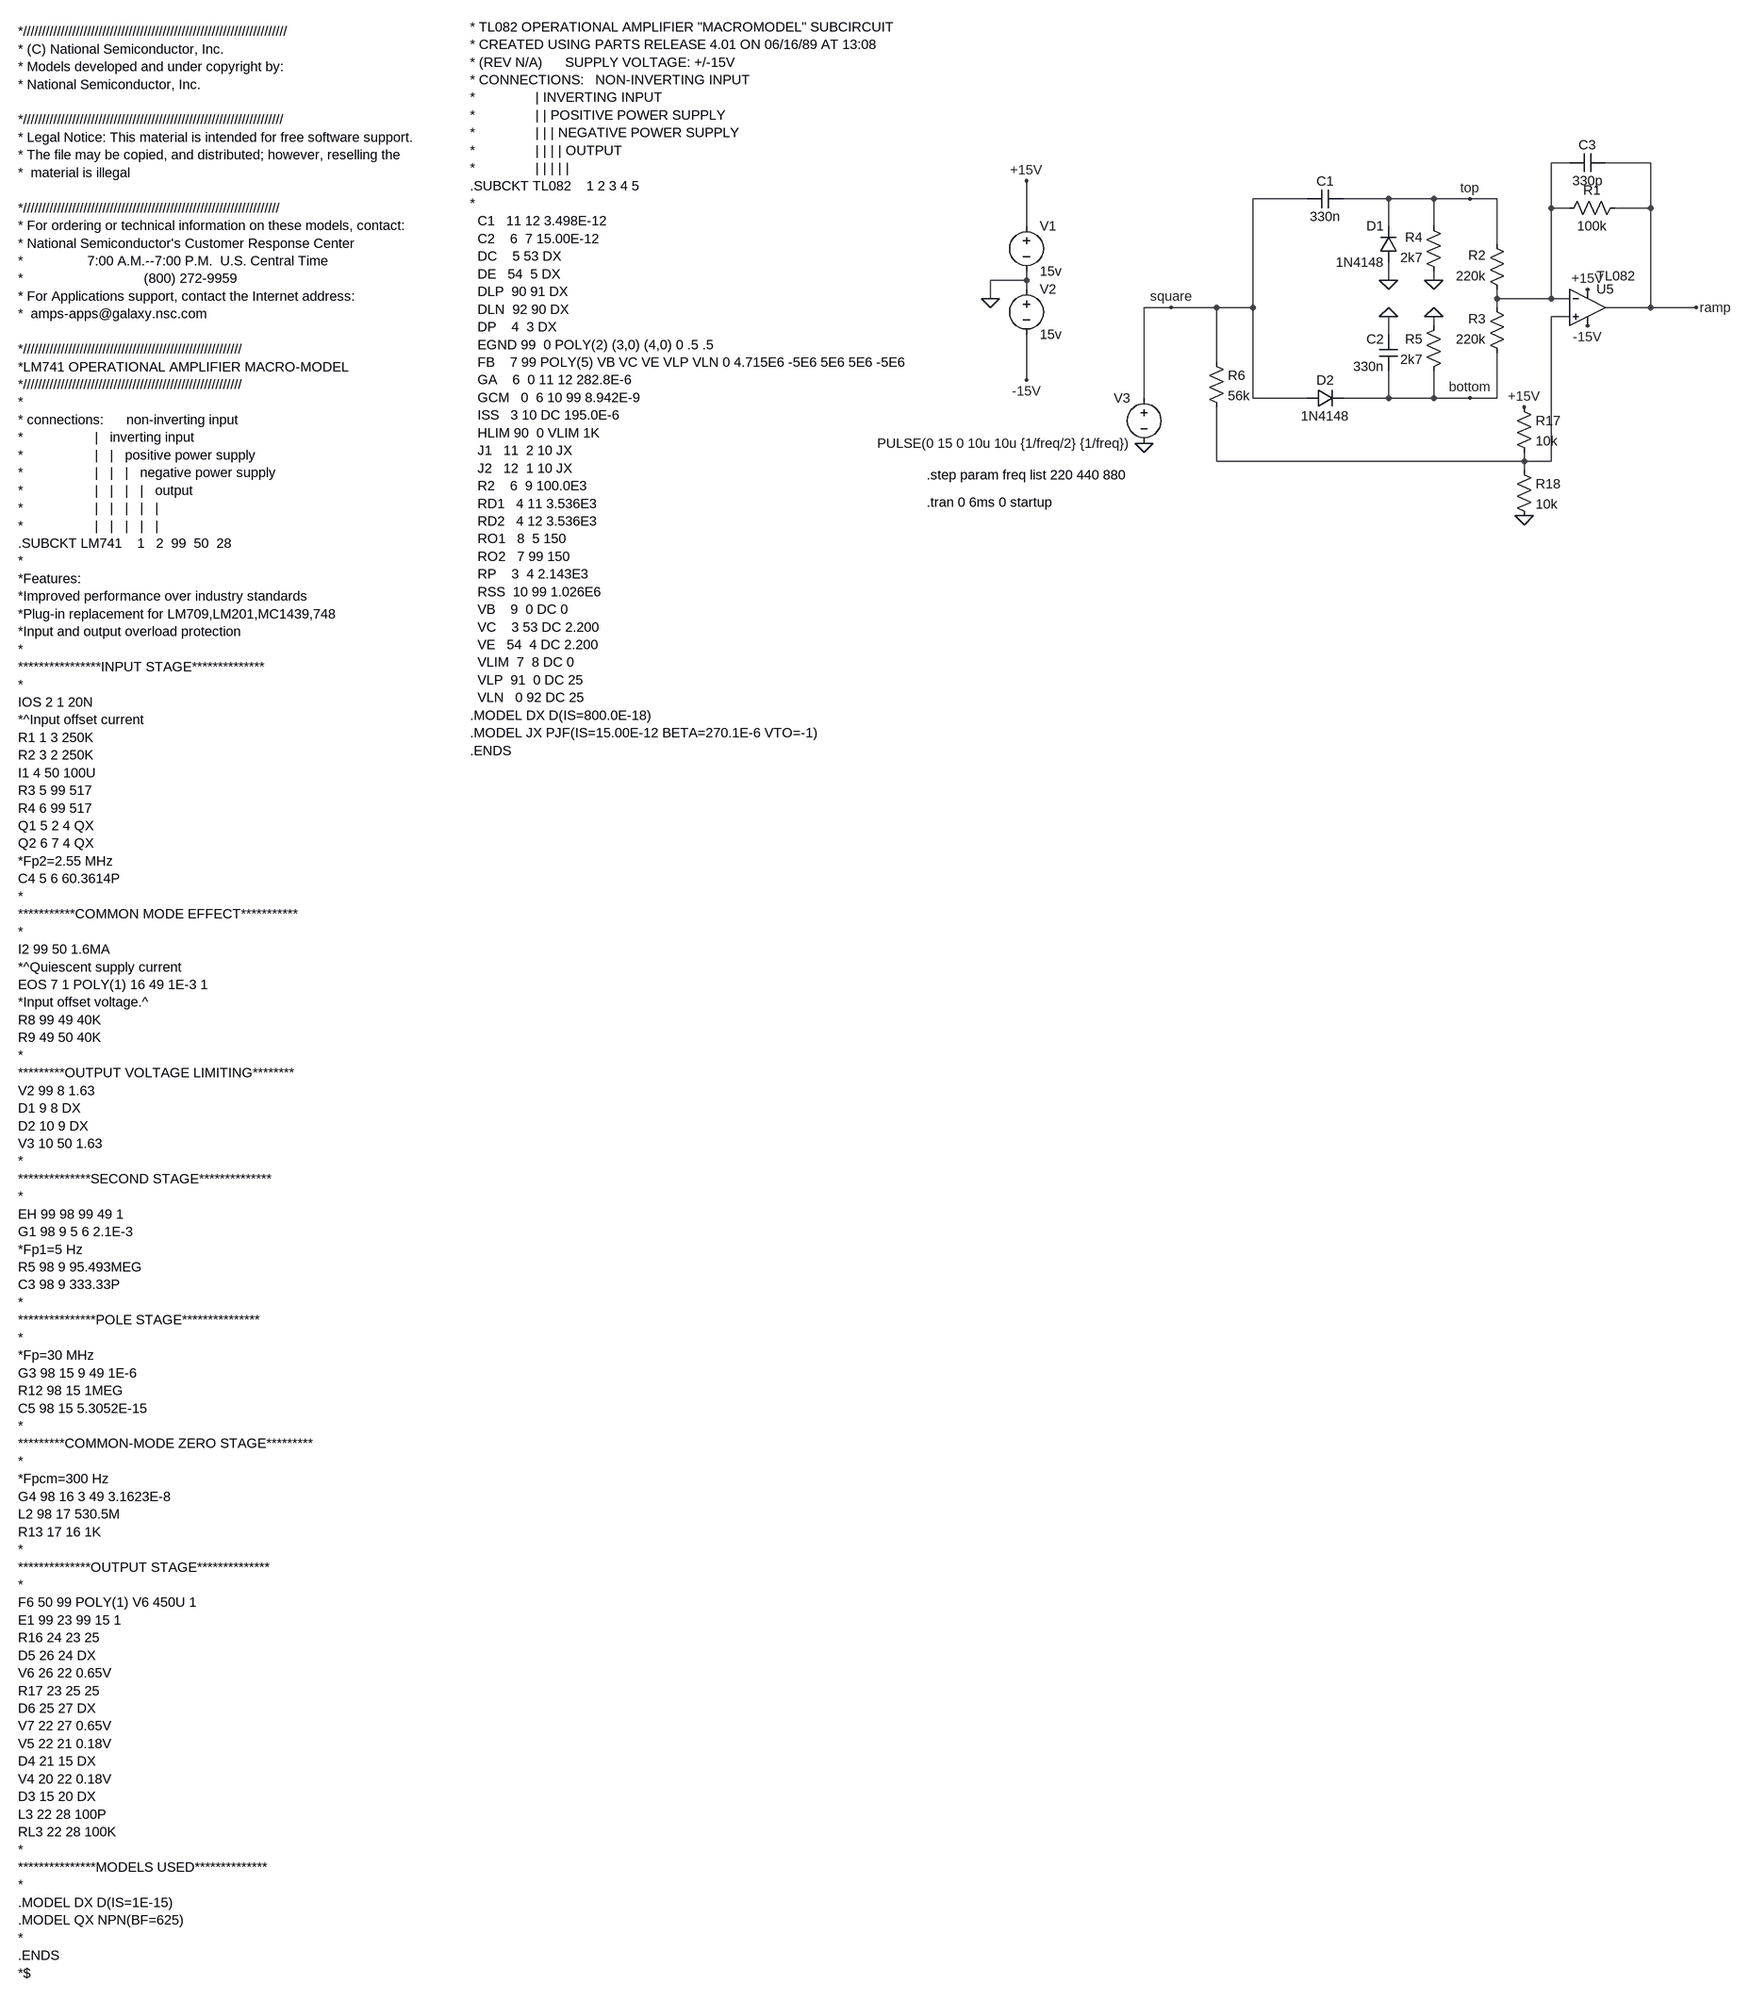
[diagram p0: schematic square2ramp.asc]
square2ramp.asc, the LTspice schematic file:
Version 4
SHEET 1 2688 2848
WIRE 272 -16 240 -16
WIRE 416 -16 336 -16
WIRE -192 48 -288 48
WIRE -48 48 -128 48
WIRE 32 48 -48 48
WIRE 96 48 32 48
WIRE 144 48 96 48
WIRE 240 64 240 -16
WIRE 272 64 240 64
WIRE 416 64 416 -16
WIRE 416 64 352 64
WIRE -688 96 -688 16
WIRE -48 96 -48 48
WIRE 32 96 32 48
WIRE 144 128 144 48
WIRE -688 192 -688 176
WIRE -688 192 -752 192
WIRE -48 192 -48 160
WIRE 32 192 32 176
WIRE -688 208 -688 192
WIRE -752 224 -752 192
WIRE 144 224 144 208
WIRE 240 224 240 64
WIRE 240 224 144 224
WIRE 272 224 240 224
WIRE -432 240 -480 240
WIRE -352 240 -432 240
WIRE -288 240 -288 48
WIRE -288 240 -352 240
WIRE 144 240 144 224
WIRE 416 240 416 64
WIRE 416 240 336 240
WIRE 496 240 416 240
WIRE 272 256 240 256
WIRE 32 272 32 256
WIRE -48 288 -48 256
WIRE -352 336 -352 240
WIRE -688 368 -688 288
WIRE -480 400 -480 240
WIRE -288 400 -288 240
WIRE -192 400 -288 400
WIRE -48 400 -48 352
WIRE -48 400 -128 400
WIRE 32 400 32 352
WIRE 32 400 -48 400
WIRE 96 400 32 400
WIRE 144 400 144 320
WIRE 144 400 96 400
WIRE -352 512 -352 416
WIRE 192 512 192 496
WIRE 192 512 -352 512
WIRE 240 512 240 256
WIRE 240 512 192 512
WIRE 192 528 192 512
FLAG -752 224 0
FLAG -688 16 +15V
FLAG -688 368 -15V
FLAG -480 480 0
FLAG 304 272 -15V
FLAG 304 208 +15V
FLAG 192 608 0
FLAG 192 416 +15V
FLAG -432 240 square
FLAG 496 240 ramp
FLAG -48 192 0
FLAG 32 192 0
FLAG -48 256 0
FLAG 32 256 0
FLAG 96 48 top
FLAG 96 400 bottom
SYMBOL voltage -688 80 R0
SYMATTR InstName V1
SYMATTR Value 15v
SYMBOL voltage -688 192 R0
SYMATTR InstName V2
SYMATTR Value 15v
SYMBOL voltage -480 384 M0
WINDOW 123 0 0 Left 0
WINDOW 39 0 0 Left 0
SYMATTR InstName V3
SYMATTR Value PULSE(0 15 0 10u 10u {1/freq/2} {1/freq})
SYMBOL Opamps\\opamp2 304 176 R0
WINDOW 3 16 8 Left 2
SYMATTR Value TL082
SYMATTR InstName U5
SYMBOL res 176 400 R0
SYMATTR InstName R17
SYMATTR Value 10k
SYMBOL res 176 512 R0
SYMATTR InstName R18
SYMATTR Value 10k
SYMBOL res 368 48 R90
WINDOW 0 0 56 VBottom 2
WINDOW 3 32 56 VTop 2
SYMATTR InstName R1
SYMATTR Value 100k
SYMBOL res 160 224 R180
WINDOW 0 36 76 Left 2
WINDOW 3 36 40 Left 2
SYMATTR InstName R2
SYMATTR Value 220k
SYMBOL res 160 336 R180
WINDOW 0 36 76 Left 2
WINDOW 3 36 40 Left 2
SYMATTR InstName R3
SYMATTR Value 220k
SYMBOL res 48 192 R180
WINDOW 0 36 76 Left 2
WINDOW 3 36 40 Left 2
SYMATTR InstName R4
SYMATTR Value 2k7
SYMBOL diode -32 160 R180
WINDOW 0 24 64 Left 2
WINDOW 3 24 0 Left 2
SYMATTR InstName D1
SYMATTR Value 1N4148
SYMBOL cap -128 32 R90
WINDOW 0 0 32 VBottom 2
WINDOW 3 32 32 VTop 2
SYMATTR InstName C1
SYMATTR Value 330n
SYMBOL res 48 256 M0
SYMATTR InstName R5
SYMATTR Value 2k7
SYMBOL diode -192 384 M90
WINDOW 0 0 32 VBottom 2
WINDOW 3 32 32 VTop 2
SYMATTR InstName D2
SYMATTR Value 1N4148
SYMBOL cap -32 288 M0
SYMATTR InstName C2
SYMATTR Value 330n
SYMBOL res -368 320 R0
SYMATTR InstName R6
SYMATTR Value 56k
SYMBOL cap 336 -32 R90
WINDOW 0 0 32 VBottom 2
WINDOW 3 32 32 VTop 2
SYMATTR InstName C3
SYMATTR Value 330p
TEXT -1672 -256 Left 2 !* TL082 OPERATIONAL AMPLIFIER "MACROMODEL" SUBCIRCUIT\n* CREATED USING PARTS RELEASE 4.01 ON 06/16/89 AT 13:08\n* (REV N/A)      SUPPLY VOLTAGE: +/-15V\n* CONNECTIONS:   NON-INVERTING INPUT\n*                | INVERTING INPUT\n*                | | POSITIVE POWER SUPPLY\n*                | | | NEGATIVE POWER SUPPLY\n*                | | | | OUTPUT\n*                | | | | |\n.SUBCKT TL082    1 2 3 4 5\n*\n  C1   11 12 3.498E-12\n  C2    6  7 15.00E-12\n  DC    5 53 DX\n  DE   54  5 DX\n  DLP  90 91 DX\n  DLN  92 90 DX\n  DP    4  3 DX\n  EGND 99  0 POLY(2) (3,0) (4,0) 0 .5 .5\n  FB    7 99 POLY(5) VB VC VE VLP VLN 0 4.715E6 -5E6 5E6 5E6 -5E6\n  GA    6  0 11 12 282.8E-6\n  GCM   0  6 10 99 8.942E-9\n  ISS   3 10 DC 195.0E-6\n  HLIM 90  0 VLIM 1K\n  J1   11  2 10 JX\n  J2   12  1 10 JX\n  R2    6  9 100.0E3\n  RD1   4 11 3.536E3\n  RD2   4 12 3.536E3\n  RO1   8  5 150\n  RO2   7 99 150\n  RP    3  4 2.143E3\n  RSS  10 99 1.026E6\n  VB    9  0 DC 0\n  VC    3 53 DC 2.200\n  VE   54  4 DC 2.200\n  VLIM  7  8 DC 0\n  VLP  91  0 DC 25\n  VLN   0 92 DC 25\n.MODEL DX D(IS=800.0E-18)\n.MODEL JX PJF(IS=15.00E-12 BETA=270.1E-6 VTO=-1)\n.ENDS
TEXT -864 584 Left 2 !.tran 0 6ms 0 startup
TEXT -2496 -248 Left 2 !*//////////////////////////////////////////////////////////////////////\n* (C) National Semiconductor, Inc.\n* Models developed and under copyright by:\n* National Semiconductor, Inc.  \n \n*/////////////////////////////////////////////////////////////////////\n* Legal Notice: This material is intended for free software support.\n* The file may be copied, and distributed; however, reselling the \n*  material is illegal\n \n*////////////////////////////////////////////////////////////////////\n* For ordering or technical information on these models, contact:\n* National Semiconductor's Customer Response Center\n*                 7:00 A.M.--7:00 P.M.  U.S. Central Time\n*                                (800) 272-9959\n* For Applications support, contact the Internet address:\n*  amps-apps@galaxy.nsc.com\n \n*//////////////////////////////////////////////////////////\n*LM741 OPERATIONAL AMPLIFIER MACRO-MODEL\n*//////////////////////////////////////////////////////////\n*\n* connections:      non-inverting input\n*                   |   inverting input\n*                   |   |   positive power supply\n*                   |   |   |   negative power supply\n*                   |   |   |   |   output\n*                   |   |   |   |   |\n*                   |   |   |   |   |\n.SUBCKT LM741    1   2  99  50  28\n*\n*Features:\n*Improved performance over industry standards\n*Plug-in replacement for LM709,LM201,MC1439,748\n*Input and output overload protection\n*\n****************INPUT STAGE**************\n*\nIOS 2 1 20N\n*^Input offset current\nR1 1 3 250K\nR2 3 2 250K\nI1 4 50 100U\nR3 5 99 517\nR4 6 99 517\nQ1 5 2 4 QX\nQ2 6 7 4 QX\n*Fp2=2.55 MHz\nC4 5 6 60.3614P\n*\n***********COMMON MODE EFFECT***********\n*\nI2 99 50 1.6MA\n*^Quiescent supply current\nEOS 7 1 POLY(1) 16 49 1E-3 1\n*Input offset voltage.^\nR8 99 49 40K\nR9 49 50 40K\n*\n*********OUTPUT VOLTAGE LIMITING********\nV2 99 8 1.63\nD1 9 8 DX\nD2 10 9 DX\nV3 10 50 1.63\n*\n**************SECOND STAGE**************\n*\nEH 99 98 99 49 1\nG1 98 9 5 6 2.1E-3\n*Fp1=5 Hz\nR5 98 9 95.493MEG\nC3 98 9 333.33P\n*\n***************POLE STAGE***************\n*\n*Fp=30 MHz\nG3 98 15 9 49 1E-6\nR12 98 15 1MEG\nC5 98 15 5.3052E-15\n*\n*********COMMON-MODE ZERO STAGE*********\n*\n*Fpcm=300 Hz\nG4 98 16 3 49 3.1623E-8\nL2 98 17 530.5M\nR13 17 16 1K\n*\n**************OUTPUT STAGE**************\n*\nF6 50 99 POLY(1) V6 450U 1\nE1 99 23 99 15 1\nR16 24 23 25\nD5 26 24 DX\nV6 26 22 0.65V\nR17 23 25 25\nD6 25 27 DX\nV7 22 27 0.65V\nV5 22 21 0.18V\nD4 21 15 DX\nV4 20 22 0.18V\nD3 15 20 DX\nL3 22 28 100P\nRL3 22 28 100K\n*\n***************MODELS USED**************\n*\n.MODEL DX D(IS=1E-15)\n.MODEL QX NPN(BF=625)\n*\n.ENDS\n*$
TEXT -864 536 Left 2 !.step param freq list 220 440 880

The netlist it stands for:
* square2ramp.asc
V1 +15V 0 15v
V2 0 -15V 15v
V3 square 0 PULSE(0 15 0 10u 10u {1/freq/2} {1/freq})
XU5 N002 N001 +15V -15V ramp TL082  ; pins In+ In- V+ V- OUT
R17 +15V N002 10k
R18 N002 0 10k
R1 ramp N001 100k
R2 N001 top 220k
R3 bottom N001 220k
R4 0 top 2k7
D1 0 top 1N4148
C1 top square 330n
R5 0 bottom 2k7
D2 square bottom 1N4148
C2 0 bottom 330n
R6 square N002 56k
C3 ramp N001 330p
.model D D
.lib standard.dio
* TL082 OPERATIONAL AMPLIFIER "MACROMODEL" SUBCIRCUIT
* CREATED USING PARTS RELEASE 4.01 ON 06/16/89 AT 13:08
* (REV N/A)      SUPPLY VOLTAGE: +/-15V
* CONNECTIONS:   NON-INVERTING INPUT
*                | INVERTING INPUT
*                | | POSITIVE POWER SUPPLY
*                | | | NEGATIVE POWER SUPPLY
*                | | | | OUTPUT
*                | | | | |
.SUBCKT TL082    1 2 3 4 5
*
  C1   11 12 3.498E-12
  C2    6  7 15.00E-12
  DC    5 53 DX
  DE   54  5 DX
  DLP  90 91 DX
  DLN  92 90 DX
  DP    4  3 DX
  EGND 99  0 POLY(2) (3,0) (4,0) 0 .5 .5
  FB    7 99 POLY(5) VB VC VE VLP VLN 0 4.715E6 -5E6 5E6 5E6 -5E6
  GA    6  0 11 12 282.8E-6
  GCM   0  6 10 99 8.942E-9
  ISS   3 10 DC 195.0E-6
  HLIM 90  0 VLIM 1K
  J1   11  2 10 JX
  J2   12  1 10 JX
  R2    6  9 100.0E3
  RD1   4 11 3.536E3
  RD2   4 12 3.536E3
  RO1   8  5 150
  RO2   7 99 150
  RP    3  4 2.143E3
  RSS  10 99 1.026E6
  VB    9  0 DC 0
  VC    3 53 DC 2.200
  VE   54  4 DC 2.200
  VLIM  7  8 DC 0
  VLP  91  0 DC 25
  VLN   0 92 DC 25
.MODEL DX D(IS=800.0E-18)
.MODEL JX PJF(IS=15.00E-12 BETA=270.1E-6 VTO=-1)
.ENDS
.tran 0 6ms 0 startup
*//////////////////////////////////////////////////////////////////////
* (C) National Semiconductor, Inc.
* Models developed and under copyright by:
* National Semiconductor, Inc.
*/////////////////////////////////////////////////////////////////////
* Legal Notice: This material is intended for free software support.
* The file may be copied, and distributed; however, reselling the
*  material is illegal
*////////////////////////////////////////////////////////////////////
* For ordering or technical information on these models, contact:
* National Semiconductor's Customer Response Center
*                 7:00 A.M.--7:00 P.M.  U.S. Central Time
*                                (800) 272-9959
* For Applications support, contact the Internet address:
*  amps-apps@galaxy.nsc.com
*//////////////////////////////////////////////////////////
*LM741 OPERATIONAL AMPLIFIER MACRO-MODEL
*//////////////////////////////////////////////////////////
*
* connections:      non-inverting input
*                   |   inverting input
*                   |   |   positive power supply
*                   |   |   |   negative power supply
*                   |   |   |   |   output
*                   |   |   |   |   |
*                   |   |   |   |   |
.SUBCKT LM741    1   2  99  50  28
*
*Features:
*Improved performance over industry standards
*Plug-in replacement for LM709,LM201,MC1439,748
*Input and output overload protection
*
****************INPUT STAGE**************
*
IOS 2 1 20N
*^Input offset current
R1 1 3 250K
R2 3 2 250K
I1 4 50 100U
R3 5 99 517
R4 6 99 517
Q1 5 2 4 QX
Q2 6 7 4 QX
*Fp2=2.55 MHz
C4 5 6 60.3614P
*
***********COMMON MODE EFFECT***********
*
I2 99 50 1.6MA
*^Quiescent supply current
EOS 7 1 POLY(1) 16 49 1E-3 1
*Input offset voltage.^
R8 99 49 40K
R9 49 50 40K
*
*********OUTPUT VOLTAGE LIMITING********
V2 99 8 1.63
D1 9 8 DX
D2 10 9 DX
V3 10 50 1.63
*
**************SECOND STAGE**************
*
EH 99 98 99 49 1
G1 98 9 5 6 2.1E-3
*Fp1=5 Hz
R5 98 9 95.493MEG
C3 98 9 333.33P
*
***************POLE STAGE***************
*
*Fp=30 MHz
G3 98 15 9 49 1E-6
R12 98 15 1MEG
C5 98 15 5.3052E-15
*
*********COMMON-MODE ZERO STAGE*********
*
*Fpcm=300 Hz
G4 98 16 3 49 3.1623E-8
L2 98 17 530.5M
R13 17 16 1K
*
**************OUTPUT STAGE**************
*
F6 50 99 POLY(1) V6 450U 1
E1 99 23 99 15 1
R16 24 23 25
D5 26 24 DX
V6 26 22 0.65V
R17 23 25 25
D6 25 27 DX
V7 22 27 0.65V
V5 22 21 0.18V
D4 21 15 DX
V4 20 22 0.18V
D3 15 20 DX
L3 22 28 100P
RL3 22 28 100K
*
***************MODELS USED**************
*
.MODEL DX D(IS=1E-15)
.MODEL QX NPN(BF=625)
*
.ENDS
*$
.step param freq list 220 440 880
.backanno
.end